# EAGLE schematic schemat1 (EAGLE 8.3.0)
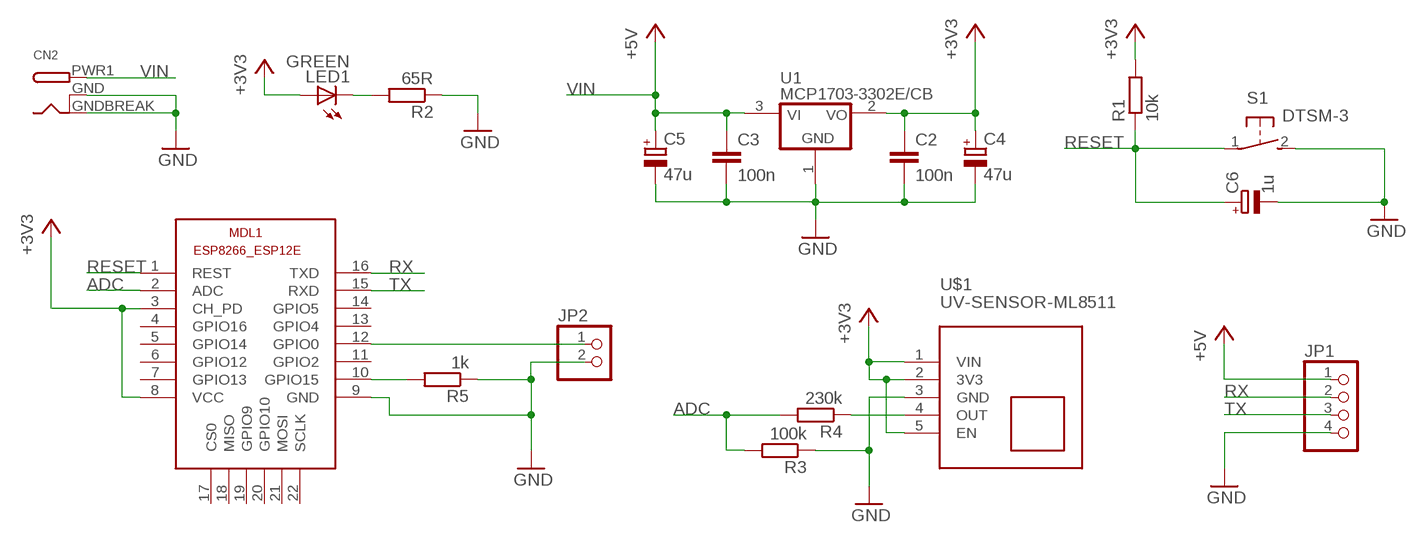
[diagram p0: schematic, sheet 1]

## Parts
C2  100n  C-EUC0805  [C0805]
C3  100n  C-EUC0805  [C0805]
C4  47u  CPOL-EUSMCD  [SMC_D]
C5  47u  CPOL-EUSMCD  [SMC_D]
C6  1u  CPOL-EUSMCA  [SMC_A]
CN2  DCBARRELSMT  [DCJACK_2MM_SMT]
JP1  PINHD-1X4  [1X04]
JP2  PINHD-1X2  [1X02]
LED1  GREEN  LEDCHIPLED_0805  [CHIPLED_0805]
MDL1  ESP8266-12EESP8266-ESP12E  [ESP8266-ESP12E]
R1  10k  R-EU_R0805  [R0805]
R2  65R  R-EU_R0805  [R0805]
R3  100k  R-EU_R0805  [R0805]
R4  230k  R-EU_R0805  [R0805]
R5  1k  R-EU_R0805  [R0805]
S1  DTSM-3  [DTSM-3]
U1  MCP1703-3302E/CB  [SOT23A_MICROCHIP_CB]
U$1  UV-SENSOR-ML8511  [UV-SENSOR-ML8511]

## Nets
+3V3: C2.1 C4.+ LED1.A MDL1.3(CH_PD) MDL1.8(VCC) R1.2 U1.2(VO) U$1.1(VIN) U$1.2(3V3) U$1.5(EN)
+5V: JP1.1
ADC: MDL1.2(ADC) R3.2 R4.2
GND: C2.2 C3.2 C4.- C5.- C6.- CN2.GND(GNDBREAK) CN2.GNDBREAK(GND) JP1.4 JP2.2 MDL1.9(GND) R2.1 R3.1 R5.1 S1.2 U1.1(GND) U$1.3(GND)
N$1: R4.1 U$1.4(OUT)
N$2: LED1.C R2.2
N$3: JP2.1 MDL1.12(GPIO0)
N$5: MDL1.10(GPIO15) R5.2
RESET: C6.+ MDL1.1(REST) R1.1 S1.1
RX: JP1.2 MDL1.16(TXD)
TX: JP1.3 MDL1.15(RXD)
VIN: C3.1 C5.+ CN2.PWR1(PWR) U1.3(VI) ; supply symbol labelled +5V
Unconnected: MDL1.4(GPIO16) MDL1.5(GPIO14) MDL1.6(GPIO12) MDL1.7(GPIO13) MDL1.11(GPIO2) MDL1.13(GPIO4) MDL1.14(GPIO5) MDL1.17(CS0) MDL1.18(MISO) MDL1.19(GPIO9) MDL1.20(GPIO10) MDL1.21(MOSI) MDL1.22(SCLK)

## Library data of the parts
C2 C3 = rcl:C-EU: CAPACITOR, European symbol
C4-C6 = rcl:CPOL-EU: POLARIZED CAPACITOR, European symbol
CN2 = adafruit:DCBARREL: 2.0mm DC Barrel Jack DCJACK_2MM_PTH - Through Hole Jack (4UConnector: 05537)
JP1 = pinhead:PINHD-1X4: PIN HEADER
JP2 = pinhead:PINHD-1X2: PIN HEADER
LED1 = adafruit:LED: LED OSRAM: - CHIPLED LG R971, LG N971, LY N971, LG Q971, LY Q971, LO R971, LY R971 LH N974, LH R974 LS Q976, LO Q976, LY Q976 LO Q996 - Hyper CHIPLED LW Q18S LB Q993, LB Q99A, LB R99A - SideLED LS A670, LO A670, LY A670, LG A670, LP A670 LB A673, LV A673, LT A673, LW A673 LH A674 LY A675 LS A676, LA A676, LO A676, LY A676, LW A676 LS A679, LY A679, LG A679 - Hyper Micro SIDELED® LS Y876, LA Y876, LO Y876, LY Y876 LT Y87S - SmartLED LW L88C, LW L88S LB L89C, LB L89S, LG L890 LS L89K, LO L89K, LY L89K LS L896, LA L896, LO L896, LY L896 - TOPLED LS T670, LO T670, LY T670, LG T670, LP T670 LSG T670, LSP T670, LSY T670, LOP T670, LYG T670 LG T671, LOG T671, LSG T671 LB T673, LV T673, LT T673, LW T673 LH T674 LS T676, LA T676, LO T676, LY T676, LB T676, LH T676, LSB T676, LW T676 LB T67C, LV T67C, LT T67C, LS T67K, LO T67K, LY T67K, LW E67C LS E67B, LA E67B, LO E67B, LY E67B, LB E67C, LV E67C, LT E67C LW T67C LS T679, LY T679, LG T679 LS T770, LO T770, LY T770, LG T770, LP T770 LB T773, LV T773, LT T773, LW T773 LH T774 LS E675, LA E675, LY E675, LS T675 LS T776, LA T776, LO T776, LY T776, LB T776 LHGB T686 LT T68C, LB T68C - Hyper Mini TOPLED® LB M676 - Mini TOPLED Santana® LG M470 LS M47K, LO M47K, LY M47K Source: http://www.osram.convergy.de/
MDL1 = ESP8266-ESP12E:ESP8266-12E: ESP8266-12E with additional I/O and GPIO04/05 corrected The author cannot warrant that this library is free from error or will meet your specific requirements. Created by PuceBaboon.com. Komagane, Nagano, JAPAN
R1-R5 = rcl:R-EU_: RESISTOR, European symbol
S1 = switch-tact:DTSM-3
U1 = _hhn_MCP1703:MCP1703*02E/CB: MCP1703[A] Series of Voltage Regulators – SOT23A (Microchip CB) (1.2 … 5.0)V, LDO, 16 V Input, 100/150/200/250 mA, Low Quiescent Current Source: http://ww1.microchip.com/downloads/en/DeviceDoc/22049f.pdf http://ww1.microchip.com/downloads/en/DeviceDoc/25122A.pdf Packages: SOT23, Microchip package identifier "CB" (dimensions and recommended land patterns acc. to Microchip) Technologies: MCP1703[A]T-xx02E/CB T : Tape and Reel xx: Output Voltage * 1000 mV; 12|15|18|25|28|30|33|40|50 0 : Extra Feature Code (fixed) 2 : Output volt. Tol.: ±2% (standard) E : Temperature range (−40…+125)°C CB: Package: SOT23A Author: Dipl.-Ing. FH Rainer Bayer HHN Hochschule Heilbronn, rainer.bayer@hs-heilbronn.de Ingenieurbüro ing-rb, mail@ing-rb.de
U$1 = diy-modules:UV-SENSOR-ML8511: UV Sensor based on ML8511 device ML8511 user's guide is available here: https://learn.sparkfun.com/tutorials/ml8511-uv-sensor-hookup-guide/using-the-ml8511 ML8511 datasheet is available here: https://www.mcs.anl.gov/research/projects/waggle/downloads/datasheets/lightsense/ml8511.pdf Click here to find device on ebay.com <http://www.ebay.com/sch/ml8511+module>